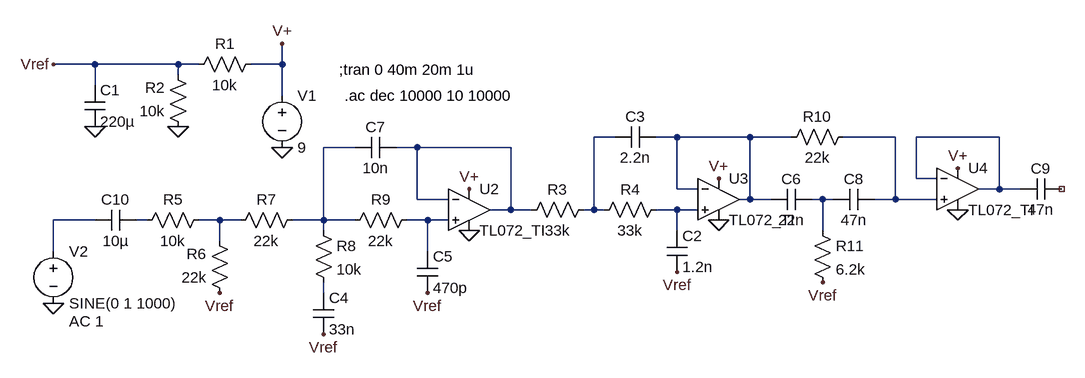
[diagram p0: schematic tech21_bass_driver_speaker_sim.asc]
tech21_bass_driver_speaker_sim.asc, the LTspice schematic file:
Version 4
SHEET 1 2196 740
WIRE 240 32 176 32
WIRE 368 32 240 32
WIRE 400 32 368 32
WIRE 528 32 528 0
WIRE 528 32 480 32
WIRE 368 48 368 32
WIRE 240 64 240 32
WIRE 528 80 528 32
WIRE 1040 144 1008 144
WIRE 1136 144 1104 144
WIRE 1248 144 1136 144
WIRE 1312 144 1248 144
WIRE 1472 144 1392 144
WIRE 1632 144 1504 144
WIRE 640 160 592 160
WIRE 736 160 704 160
WIRE 880 160 736 160
WIRE 1504 208 1504 144
WIRE 1536 208 1504 208
WIRE 1136 224 1136 144
WIRE 1168 224 1136 224
WIRE 1632 224 1632 144
WIRE 1632 224 1600 224
WIRE 1664 224 1632 224
WIRE 736 240 736 160
WIRE 784 240 736 240
WIRE 1248 240 1248 144
WIRE 1248 240 1232 240
WIRE 1280 240 1248 240
WIRE 1360 240 1344 240
WIRE 1376 240 1360 240
WIRE 1472 240 1472 144
WIRE 1472 240 1440 240
WIRE 1536 240 1472 240
WIRE 880 256 880 160
WIRE 880 256 848 256
WIRE 912 256 880 256
WIRE 1008 256 1008 144
WIRE 1008 256 992 256
WIRE 1024 256 1008 256
WIRE 1136 256 1104 256
WIRE 1168 256 1136 256
WIRE 240 272 176 272
WIRE 320 272 304 272
WIRE 432 272 400 272
WIRE 464 272 432 272
WIRE 592 272 592 160
WIRE 592 272 544 272
WIRE 640 272 592 272
WIRE 752 272 720 272
WIRE 784 272 752 272
WIRE 592 288 592 272
WIRE 1136 288 1136 256
WIRE 1360 288 1360 240
WIRE 432 304 432 272
WIRE 176 320 176 272
WIRE 752 320 752 272
WIRE 592 384 592 368
FLAG 528 160 0
FLAG 528 0 V+
FLAG 176 400 0
FLAG 176 32 Vref
FLAG 368 128 0
FLAG 240 128 0
FLAG 432 384 Vref
FLAG 816 224 V+
FLAG 816 288 0
FLAG 1200 208 V+
FLAG 1200 272 0
FLAG 1568 192 V+
FLAG 1568 256 0
FLAG 592 448 Vref
FLAG 752 384 Vref
FLAG 1136 352 Vref
FLAG 1360 368 Vref
SYMBOL voltage 528 64 R0
WINDOW 123 0 0 Left 2
WINDOW 39 0 0 Left 2
SYMATTR InstName V1
SYMATTR Value 9
SYMBOL voltage 176 304 R0
WINDOW 123 24 124 Left 2
WINDOW 39 0 0 Left 2
SYMATTR Value2 AC 1
SYMATTR InstName V2
SYMATTR Value SINE(0 1 1000)
SYMBOL res 496 16 R90
WINDOW 0 0 56 VBottom 2
WINDOW 3 32 56 VTop 2
SYMATTR InstName R1
SYMATTR Value 10k
SYMBOL res 384 144 R180
WINDOW 0 36 76 Left 2
WINDOW 3 36 40 Left 2
SYMATTR InstName R2
SYMATTR Value 10k
SYMBOL cap 224 64 R0
SYMATTR InstName C1
SYMATTR Value 220µ
SYMBOL res 416 256 R90
WINDOW 0 0 56 VBottom 2
WINDOW 3 32 56 VTop 2
SYMATTR InstName R5
SYMATTR Value 10k
SYMBOL res 448 400 R180
WINDOW 0 36 76 Left 2
WINDOW 3 36 40 Left 2
SYMATTR InstName R6
SYMATTR Value 22k
SYMBOL res 448 288 R270
WINDOW 0 32 56 VTop 2
WINDOW 3 0 56 VBottom 2
SYMATTR InstName R7
SYMATTR Value 22k
SYMBOL res 576 272 R0
SYMATTR InstName R8
SYMATTR Value 10k
SYMBOL cap 576 384 R0
SYMATTR InstName C4
SYMATTR Value 33n
SYMBOL res 736 256 R90
WINDOW 0 0 56 VBottom 2
WINDOW 3 32 56 VTop 2
SYMATTR InstName R9
SYMATTR Value 22k
SYMBOL cap 736 320 R0
SYMATTR InstName C5
SYMATTR Value 470p
SYMBOL cap 704 144 R90
WINDOW 0 0 32 VBottom 2
WINDOW 3 32 32 VTop 2
SYMATTR InstName C7
SYMATTR Value 10n
SYMBOL res 1008 240 R90
WINDOW 0 0 56 VBottom 2
WINDOW 3 32 56 VTop 2
SYMATTR InstName R3
SYMATTR Value 33k
SYMBOL res 1120 240 R90
WINDOW 0 0 56 VBottom 2
WINDOW 3 32 56 VTop 2
SYMATTR InstName R4
SYMATTR Value 33k
SYMBOL cap 1120 288 R0
SYMATTR InstName C2
SYMATTR Value 1.2n
SYMBOL cap 1104 128 R90
WINDOW 0 0 32 VBottom 2
WINDOW 3 32 32 VTop 2
SYMATTR InstName C3
SYMATTR Value 2.2n
SYMBOL res 1408 128 R90
WINDOW 0 0 56 VBottom 2
WINDOW 3 32 56 VTop 2
SYMATTR InstName R10
SYMATTR Value 22k
SYMBOL cap 1344 224 R90
WINDOW 0 0 32 VBottom 2
WINDOW 3 32 32 VTop 2
SYMATTR InstName C6
SYMATTR Value 22n
SYMBOL cap 1440 224 R90
WINDOW 0 0 32 VBottom 2
WINDOW 3 32 32 VTop 2
SYMATTR InstName C8
SYMATTR Value 47n
SYMBOL res 1344 272 R0
SYMATTR InstName R11
SYMATTR Value 6.2k
SYMBOL cap 1728 208 R90
WINDOW 0 0 32 VBottom 2
WINDOW 3 32 32 VTop 2
SYMATTR InstName C9
SYMATTR Value 47n
SYMBOL EXTRA\\AudioOpamp\\TI\\TL072_TI 816 256 R0
SYMATTR InstName U2
SYMBOL EXTRA\\AudioOpamp\\TI\\TL072_TI 1200 240 R0
SYMATTR InstName U3
SYMBOL EXTRA\\AudioOpamp\\TI\\TL072_TI 1568 224 R0
SYMATTR InstName U4
SYMBOL cap 304 256 R90
WINDOW 0 0 32 VBottom 2
WINDOW 3 32 32 VTop 2
SYMATTR InstName C10
SYMATTR Value 10µ
TEXT 616 40 Left 2 !;tran 0 40m 20m 1u
TEXT 624 80 Left 2 !.ac dec 10000 10 10000

The netlist it stands for:
* tech21_bass_driver_speaker_sim.asc
V1 V+ 0 9
V2 N009 0 SINE(0 1 1000) AC 1
R1 V+ Vref 10k
R2 0 Vref 10k
C1 Vref 0 220µ
R5 N011 N010 10k
R6 Vref N011 22k
R7 N011 N005 22k
R8 N005 N013 10k
C4 N013 Vref 33n
R9 N012 N005 22k
C5 N012 Vref 470p
C7 N006 N005 10n
R3 N001 N006 33k
R4 N008 N001 33k
C2 N008 Vref 1.2n
C3 N002 N001 2.2n
R10 N003 N002 22k
C6 N007 N002 22n
C8 N003 N007 47n
R11 N007 Vref 6.2k
C9 NC_01 N004 47n
* U2: TL072_TI (symbol EXTRA\AudioOpamp\TI\TL072_TI not available, pins judged from their places): In+=N012 In-=N006 V+=V+ V-=0 OUT=N006
* U3: TL072_TI (symbol EXTRA\AudioOpamp\TI\TL072_TI not available, pins judged from their places): In+=N008 In-=N002 V+=V+ V-=0 OUT=N002
* U4: TL072_TI (symbol EXTRA\AudioOpamp\TI\TL072_TI not available, pins judged from their places): In+=N003 In-=N004 V+=V+ V-=0 OUT=N004
C10 N010 N009 10µ
;tran 0 40m 20m 1u
.ac dec 10000 10 10000
.backanno
.end